# EasyEDA Pro project ProDoc_v03_CLOCK_4Plane_2025-01-28.epro

# Schematic v03_CLOCK_4Plane

## Sheets
1 v03_CLOCK_4Plane_Page1: Board Name: v03_CLOCK_4Plane; Create Date: 2024-08-20; Page Name: v03_CLOCK_4Plane_Page1; Project Name: The20c_v03; Schematic Name: v03_CLOCK_4Plane; Update Date: 2024-12-30; Company: OsoLabs.tech; Drawn: OsoLabs.tech; Page Size: A4; Part Number: v03_CLOCK_4Plane; Reviewed: OsoLabs.tech; Version: V3.0
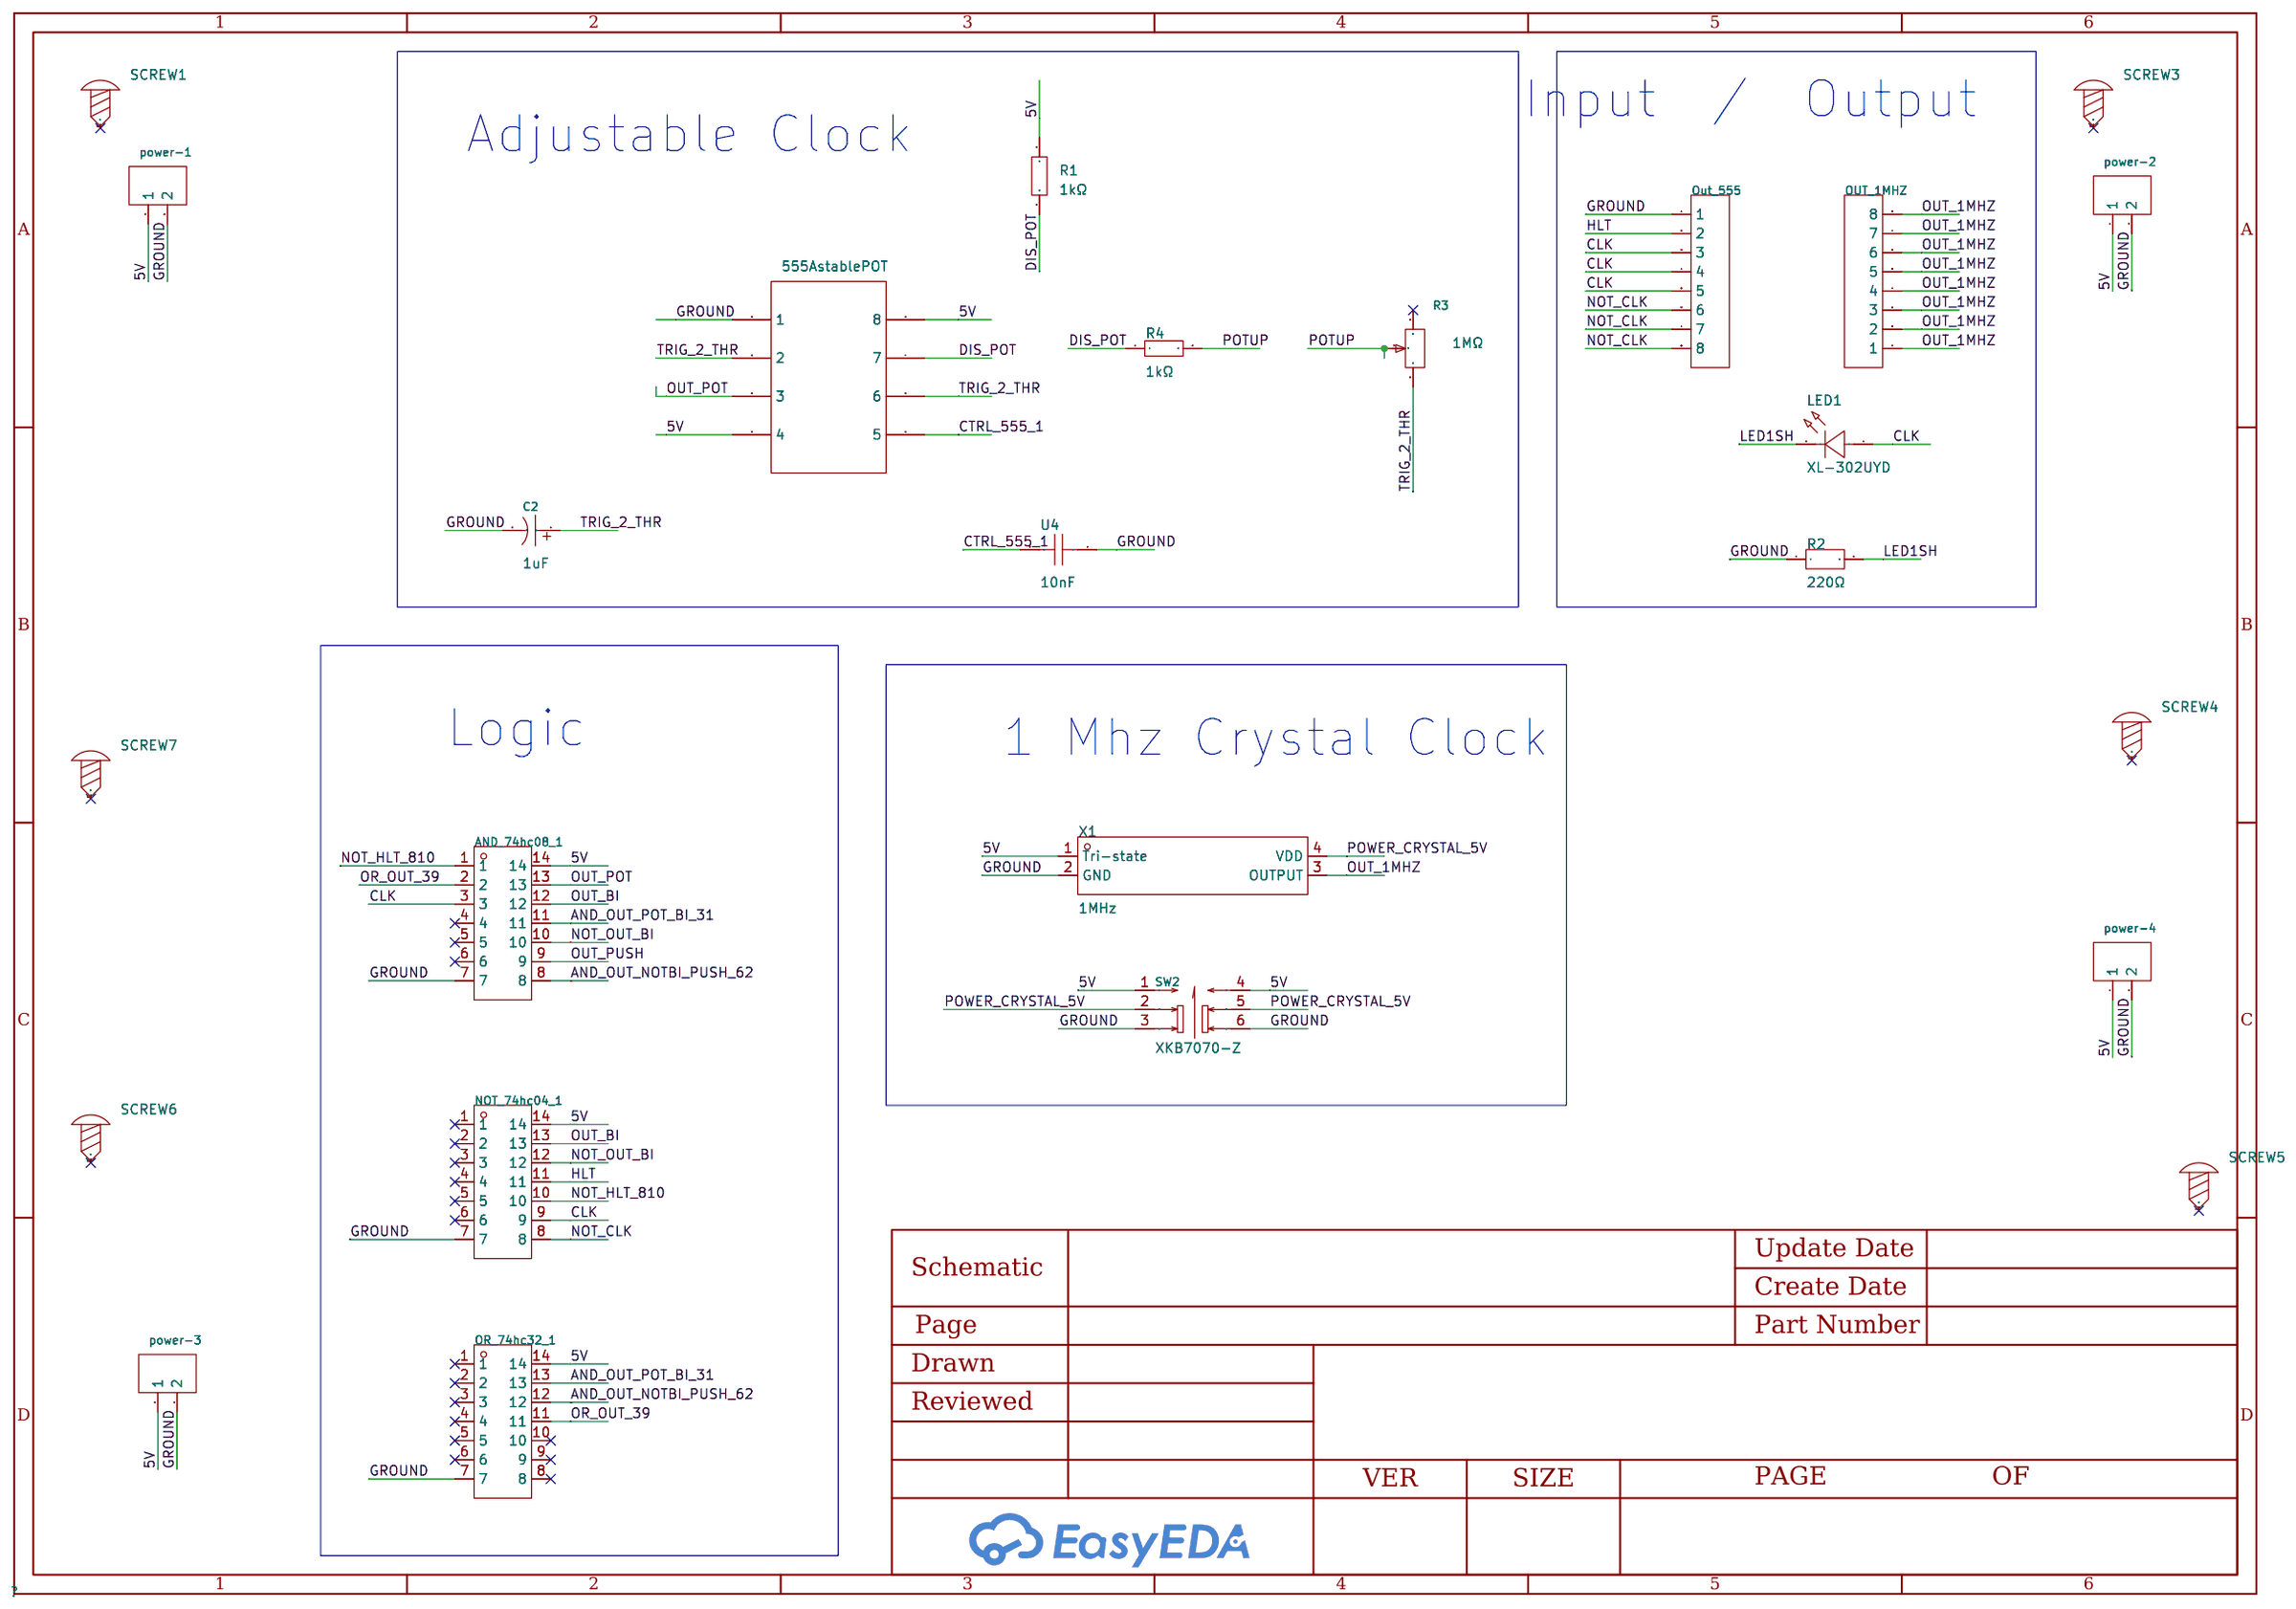
[diagram p0: v03_CLOCK_4Plane_Page1]
2 v03_CLOCK_4Plane_Page2: Create Date: 2024-12-30; Page Name: v03_CLOCK_4Plane_Page2
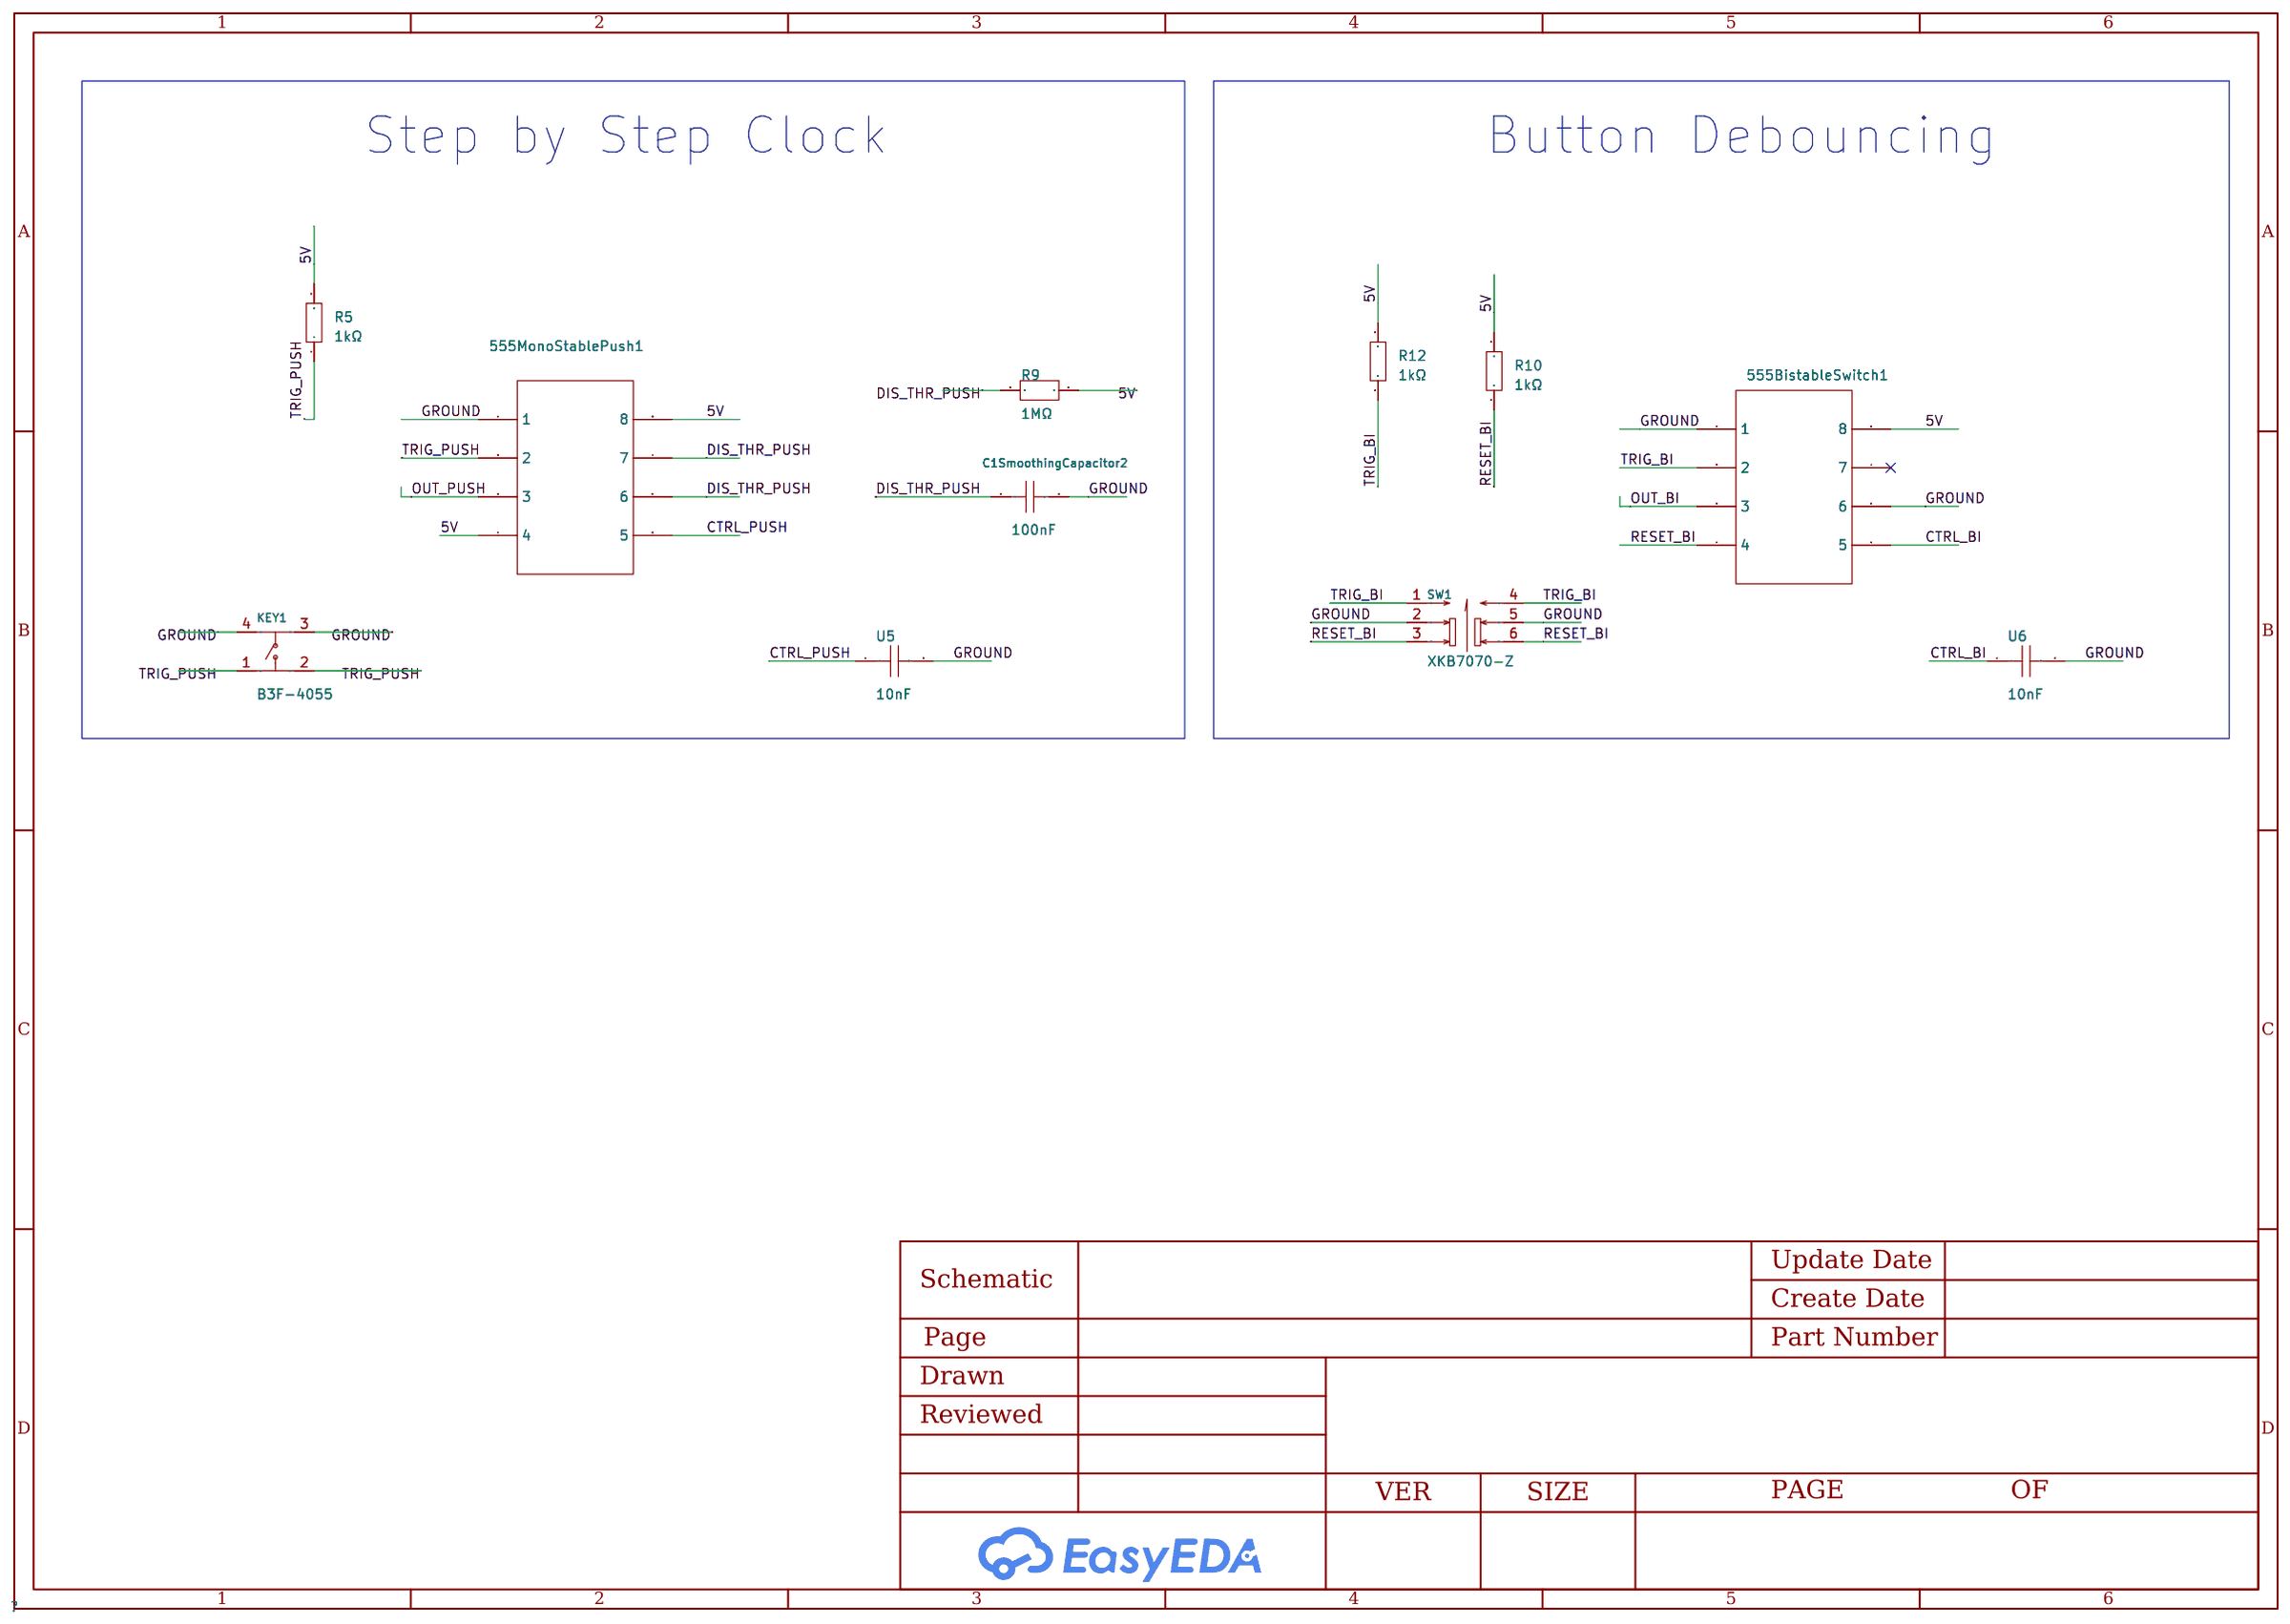
[diagram p1: v03_CLOCK_4Plane_Page2]

## Parts
sheet v03_CLOCK_4Plane_Page1
555AstablePOT  DS1009-08AT1NX-0A2  [DIP-8_L10.2-W10.2-P2.54-LS7.6-BL]
AND_74hc08_1  IC-14P窄  [DIP-14_L17.8-W10.2-P2.54-BL]
C2  1uF  [CAP-TH_BD5.0-P2.00-D0.8-FD]
LED1  XL-302UYD  [LED-TH_BD3.8-P2.54-FD_YELLOW]
NOT_74hc04_1  IC-14P窄  [DIP-14_L17.8-W10.2-P2.54-BL]
OR_74hc32_1  IC-14P窄  [DIP-14_L17.8-W10.2-P2.54-BL]
OUT_1MHZ  2.54-1*8P母环保  [HDR-TH_8P-P2.54-V-F-1]
Out_555  2.54-1*8P母环保  [HDR-TH_8P-P2.54-V-F-1]
power-1  2.54-1*2P母  [HDR-TH_2P-P2.54-V-F]
power-2  2.54-1*2P母  [HDR-TH_2P-P2.54-V-F]
power-3  2.54-1*2P母  [HDR-TH_2P-P2.54-V-F]
power-4  2.54-1*2P母  [HDR-TH_2P-P2.54-V-F]
R1  1kΩ  [RES-TH_BD2.7-L6.2-P10.20-D0.4]
R2  220Ω  [RES-TH_BD2.7-L6.2-P10.20-D0.4]
R3  1MΩ  [RES-ADJ-TH_3296W]
R4  1kΩ  [RES-TH_BD2.7-L6.2-P10.20-D0.4]
SCREW1  -  [Screw-Hole-M3]
SCREW3  -  [Screw-Hole-M3]
SCREW4  -  [Screw-Hole-M3]
SCREW5  -  [Screw-Hole-M3]
SCREW6  -  [Screw-Hole-M3]
SCREW7  -  [Screw-Hole-M3]
SW2  XKB7070-Z  [SW-TH_6P-L7.0-W7.0-P2.00]
U4  10nF  [CAP-TH_L4.8-W3.2-P5.08-D1.2]
X1  1MHz  [OSC-SMD_4P-L7.0-W5.0-BL_7W16070003]
sheet v03_CLOCK_4Plane_Page2
555BistableSwitch1  DS1009-08AT1NX-0A2  [DIP-8_L10.2-W10.2-P2.54-LS7.6-BL]
555MonoStablePush1  DS1009-08AT1NX-0A2  [DIP-8_L10.2-W10.2-P2.54-LS7.6-BL]
C1SmoothingCapacitor2  100nF  [CAP-TH_L5.8-W2.4-P2.54-D0.6]
KEY1  B3F-4055  [KEY-TH_4P-L12.0-W12.0-P5.00-LS13.4-EH]
R5  1kΩ  [RES-TH_BD2.7-L6.2-P10.20-D0.4]
R9  1MΩ  [RES-TH_BD2.7-L6.2-P10.20-D0.4]
R10  1kΩ  [RES-TH_BD2.7-L6.2-P10.20-D0.4]
R12  1kΩ  [RES-TH_BD2.7-L6.2-P10.20-D0.4]
SW1  XKB7070-Z  [SW-TH_6P-L7.0-W7.0-P2.00]
U5  10nF  [CAP-TH_L4.8-W3.2-P5.08-D1.2]
U6  10nF  [CAP-TH_L4.8-W3.2-P5.08-D1.2]

## Library data of the parts
555AstablePOT 555BistableSwitch1 555MonoStablePush1 = DS1009-08AT1NX-0A2: IC Type:DIP Pitch:2.54mm Row Spacing:7.62mm Number of Positions:8P Contact Plating:Tin; LCSC Part Name: 间距2.54mm P数:8P; Supplier Part: C72124; Manufacturer: CONNFLY; Supplier Footprint: DIP-8; JLCPCB Part Class: Extended Part; Datasheet: https://atta.szlcsc.com/upload/public/pdf/source/20160429/1461922462758.pdf; Supplier: LCSC; IC Type: DIP; Pitch: 2.54mm; Row Spacing: 7.62mm; Number of Positions: 8P; Contact Plating: Tin
AND_74hc08_1 NOT_74hc04_1 OR_74hc32_1 = IC-14P窄: IC Type:DIP Pitch:2.54mm Row Spacing:7.62mm Number of Positions:14P Contact Plating:-; LCSC Part Name: 间距2.54mm P数:14P; Supplier Part: C2325; Manufacturer: BOOMELE(博穆精密); Supplier Footprint: DIP-14; JLCPCB Part Class: Extended Part; Datasheet: https://atta.szlcsc.com/upload/public/pdf/source/20151118/1457707579760.pdf; Supplier: LCSC; IC Type: DIP; Pitch: 2.54mm; Row Spacing: 7.62mm; Number of Positions: 14P
C2 = KF010M050C110A: Capacitance: Tolerance:±20% Tolerance:±20% Rated Voltage: Lead Spacing: φD: L: Lifetime @ Temp:2000hrs@105℃; LCSC Part Name: 1uF ±20% 50V; Supplier Part: C62934; Manufacturer: CapXon(丰宾); Supplier Footprint: 插件,D5xL11mm; JLCPCB Part Class: Extended Part; Datasheet: https://atta.szlcsc.com/upload/public/pdf/source/20160702/1467448308274.pdf; Supplier: LCSC; Tolerance: ±20%; Lifetime @ Temp: 2000hrs@105℃
LED1 = XL-302UYD: Lamp Holder Type:3mm圆形灯头 Emitted Color:Yellow Power Dissipation:80mW Forward Current:30mA Dominant Wavelength:585nm~590nm Dominant Wavelength:585nm~590nm Peak Wavelength:595nm Lens Color:黄色透镜 Color Temperature:- Color Temperature:- Viewing Angle:50° Mount; Supplier Part: C2895472; Manufacturer: XINGLIGHT(成兴光); Supplier Footprint: 插件,D=3mm; JLCPCB Part Class: Extended Part; Datasheet: https://atta.szlcsc.com/upload/public/pdf/source/20240112/80AE8C6861133F27C2471F21BB0705B6.pdf; Supplier: LCSC; Lamp Holder Type: 3mm圆形灯头; Emitted Color: Yellow; Power Dissipation: 80mW; Forward Current: 30mA; Dominant Wavelength: 585nm~590nm; Peak Wavelength: 595nm; Lens Color: 黄色透镜; Viewing Angle: 50°; Operating Temperature: -25℃~+85℃
OUT_1MHZ Out_555 = 2.54-1*8P母环保: Holes Structure:1x8P Pitch:2.54mm Row Spacing:- Mounting Type:Straight Number of Rows:Plugin Number of Holes:8P Insulation Height:- Contact Material:- Contact Plating:-; LCSC Part Name: 间距:2.54mm 1x8P 直插; Supplier Part: C27438; Manufacturer: BOOMELE(博穆精密); Supplier Footprint: 插件,P=2.54mm; JLCPCB Part Class: Extended Part; Datasheet: https://atta.szlcsc.com/upload/public/pdf/source/20231221/1CA800C6799ED97958773716FAA1BFFE.pdf; Supplier: LCSC; Holes Structure: 1x8P; Pitch: 2.54mm; Mounting Type: Straight; Number of Rows: Plugin; Number of Holes: 8P
power-1-power-4 = 2.54-1*2P母: Holes Structure:1x2P Pitch:2.54mm Row Spacing:- Mounting Type:Straight Number of Rows:Plugin Number of Holes:2P Insulation Height:- Contact Material:- Contact Plating:-; LCSC Part Name: 间距:2.54mm 1x2P 直插; Supplier Part: C49661; Manufacturer: BOOMELE(博穆精密); Supplier Footprint: 插件,P=2.54mm; JLCPCB Part Class: Extended Part; Datasheet: https://atta.szlcsc.com/upload/public/pdf/source/20210301/C2718488_F4427B881E42CAA8DDB0B1C12B3A522C.pdf; Supplier: LCSC; Holes Structure: 1x2P; Pitch: 2.54mm; Mounting Type: Straight; Number of Rows: Plugin; Number of Holes: 2P
R1 R4 R5 R10 R12 = CR1/4W-1K±5%-ST26: Type:Carbon Resister Resistance: Tolerance:±5% Tolerance:±5% Overload Voltage (Max):250V Power(Watts):250mW Temperature Coefficient:±350ppm/℃ Temperature Coefficient:±350ppm/℃ Operating Temperature Range:-55℃~+155℃ Operating Temperature Range:-55℃~+155℃; LCSC Part Name: 碳膜电阻 1kΩ ±5% 250mW; Supplier Part: C2894606; Manufacturer: VO(翔胜); Supplier Footprint: 插件,2.7x6.2mm; JLCPCB Part Class: Extended Part; Datasheet: https://atta.szlcsc.com/upload/public/pdf/source/20210803/C2857407_45FF53FE186CAB545115AD37303966CD.pdf; Supplier: LCSC; Type: Carbon Resister; Tolerance: ±5%; Overload Voltage (Max): 250V; Power(Watts): 250mW; Temperature Coefficient: ±350ppm/℃; Operating Temperature Range: -55℃~+155℃
R2 = CR1/4W-220Ω±5%-ST26: Type:Carbon Resister Resistance: Tolerance:±5% Tolerance:±5% Overload Voltage (Max):250V Power(Watts):250mW Temperature Coefficient:±350ppm/℃ Temperature Coefficient:±350ppm/℃ Operating Temperature Range:-55℃~+155℃ Operating Temperature Range:-55℃~+155℃; LCSC Part Name: 碳膜电阻 220Ω ±5% 250mW; Supplier Part: C2894616; Manufacturer: VO(翔胜); Supplier Footprint: 插件,D2.7xL6.2mm; JLCPCB Part Class: Extended Part; Datasheet: https://atta.szlcsc.com/upload/public/pdf/source/20210803/C2857407_45FF53FE186CAB545115AD37303966CD.pdf; Supplier: LCSC; Type: Carbon Resister; Tolerance: ±5%; Overload Voltage (Max): 250V; Power(Watts): 250mW; Temperature Coefficient: ±350ppm/℃; Operating Temperature Range: -55℃~+155℃
R3 = 3296W-1-105-8mm: Resistance: Tolerance:±10% Tolerance:±10%; LCSC Part Name: 1MΩ ±10%; Supplier Part: C330438; Manufacturer: BOCHEN(博晨); Supplier Footprint: 插件; JLCPCB Part Class: Extended Part; Datasheet: https://atta.szlcsc.com/upload/public/pdf/source/20181127/C330438_D4133D377B8EE5AAFCEADB9B9868ED36.pdf; Supplier: LCSC; Tolerance: ±10%
SCREW1 SCREW3-SCREW7 = Screw-Hole-M3: Supplier Footprint: 插件
SW1 SW2 = XKB7070-Z: Self Lock / No Lock:LATCHING Actuator Style:Rectangle button IP Rating:- Mounting Style:Straight Contact Current:100mA Voltage Rating (AC):250V Voltage Rating (DC):30V Insulation Resistance:100MΩ Actuator/Cap Color:Blue With Lamp:不带 Pin Style:PCPin Operat; LCSC Part Name: 按键开关   7*7插件自锁 蓝白黑; Supplier Part: C318863; Manufacturer: XKB Connectivity(中国星坤); Supplier Footprint: 插件; JLCPCB Part Class: Extended Part; Datasheet: https://atta.szlcsc.com/upload/public/pdf/source/20211015/75A682A27A424BDE8D93C2CFA14C38FE.pdf; Supplier: LCSC; Self Lock / No Lock: LATCHING; Actuator Style: Rectangle button; Mounting Style: Straight; Contact Current: 100mA; Voltage Rating (AC): 250V; Voltage Rating (DC): 30V; Insulation Resistance: 100MΩ; Actuator/Cap Color: Blue; With Lamp: 不带; Pin Style: PCPin; Operating Force: 160gf; Operating Temperature: -15℃~+55℃; Mechanical Life: 10万次
U4-U6 = CC1H103ZC1ED3F4D1100: Capacitance:10nF Tolerance:-20%~+80% Tolerance:-20%~+80% Voltage Rated: Lead Spacing: Temperature Coefficient: φD: Body Thickness:2.6mm; LCSC Part Name: 10nF -20%~+80% 50V; Supplier Part: C2761727; Manufacturer: Dersonic(德尔创); Supplier Footprint: 插件,P=5.08mm; JLCPCB Part Class: Extended Part; Datasheet: https://atta.szlcsc.com/upload/public/pdf/source/20211026/557BD244E4A8D86E9C6A3DB53C19BB73.pdf; Supplier: LCSC; Tolerance: -20%~+80%; Body Thickness: 2.6mm
X1 = S7D1.000000A20F30T: Frequency:1MHz Normal temperature Frequency Tolerance:±20ppm Normal temperature Frequency Tolerance:±20ppm Output Type:CMOS Supply Voltage:5V Supply Voltage:5V Supply Current (Max):10mA Frequency Stability(Full temperature range):±30ppm Frequency Stabilit; LCSC Part Name: 1MHz ±20ppm 5V CMOS; Supplier Part: C386887; Manufacturer: SCTF(星通时频); Supplier Footprint: SMD7050-4P; JLCPCB Part Class: Extended Part; Datasheet: https://atta.szlcsc.com/upload/public/pdf/source/20220428/A9C559F2882A09E13E49EAE9C5A8F46A.pdf; Supplier: LCSC; Normal temperature Frequency Tolerance: ±20ppm; Output Type: CMOS; Supply Voltage: 5V; Supply Current (Max): 10mA; Frequency Stability(Full temperature range): ±30ppm; Operating Temperature: -40℃~+85℃
C1SmoothingCapacitor2 = CC1H104ZA1ED3F5P1100: Capacitance:100nF Tolerance:-20%~+80% Tolerance:-20%~+80% Voltage Rated: Lead Spacing: Temperature Coefficient: φD: Body Thickness:2.4mm; LCSC Part Name: 100nF -20%~+80% 50V; Supplier Part: C2832506; Manufacturer: Dersonic(德尔创); Supplier Footprint: 插件,P=2.54mm; JLCPCB Part Class: Extended Part; Datasheet: https://atta.szlcsc.com/upload/public/pdf/source/20211027/619020FDD8EBC9BBFCA73A5584FA164D.pdf; Supplier: LCSC; Tolerance: -20%~+80%; Body Thickness: 2.4mm
KEY1 = B3F-4055_C84931: Circuit:SPST Actuator Style:Rectangle button Mounting Style:Straight Switch Length:12mm Switch Width:12mm Switch Height:7.3mm Contact Current:50mA Voltage Rating (DC):24V With Lamp:- Mechanical Life:-; LCSC Part Name: 12*12*7.3mm 直插 轻触开关; Supplier Part: C84931; Manufacturer: OMRON(欧姆龙); Supplier Footprint: 插件; JLCPCB Part Class: Extended Part; Datasheet: https://atta.szlcsc.com/upload/public/pdf/source/20170810/C93157_1502335414592880008.pdf; Supplier: LCSC; Circuit: SPST; Actuator Style: Rectangle button; Mounting Style: Straight; Switch Length: 12mm; Switch Width: 12mm; Switch Height: 7.3mm; Contact Current: 50mA; Voltage Rating (DC): 24V
R9 = CR1/4W-1M±5%-ST52: Type:Carbon Resister Resistance: Tolerance:±5% Tolerance:±5% Overload Voltage (Max):250V Power(Watts):250mW Temperature Coefficient:±1000ppm/℃ Temperature Coefficient:±1000ppm/℃ Operating Temperature Range:-55℃~+155℃ Operating Temperature Range:-55℃~+155℃; LCSC Part Name: 碳膜电阻 1MΩ ±5% 250mW; Supplier Part: C2894664; Manufacturer: VO(翔胜); Supplier Footprint: 插件,D2.7xL6.2mm; JLCPCB Part Class: Extended Part; Datasheet: https://atta.szlcsc.com/upload/public/pdf/source/20210803/C2857407_45FF53FE186CAB545115AD37303966CD.pdf; Supplier: LCSC; Type: Carbon Resister; Tolerance: ±5%; Overload Voltage (Max): 250V; Power(Watts): 250mW; Temperature Coefficient: ±1000ppm/℃; Operating Temperature Range: -55℃~+155℃

## Nets
5V: 555AstablePOT.4 555AstablePOT.8 555BistableSwitch1.8 555MonoStablePush1.4 555MonoStablePush1.8 AND_74hc08_1.14 NOT_74hc04_1.14 OR_74hc32_1.14 power-1.1 power-2.1 power-3.1 power-4.1 R1.2 R5.2 R9.1 R10.2 R12.2 SW2.1 SW2.4 X1.1(Tri-state)
AND_OUT_NOTBI_PUSH_62: AND_74hc08_1.8 OR_74hc32_1.12
AND_OUT_POT_BI_31: AND_74hc08_1.11 OR_74hc32_1.13
CLK: AND_74hc08_1.3 LED1.1(A) NOT_74hc04_1.9 Out_555.3 Out_555.4 Out_555.5
CTRL_555_1: 555AstablePOT.5 U4.1
CTRL_BI: 555BistableSwitch1.5 U6.1
CTRL_PUSH: 555MonoStablePush1.5 U5.1
DIS_POT: 555AstablePOT.7 R1.1 R4.1
DIS_THR_PUSH: 555MonoStablePush1.6 555MonoStablePush1.7 C1SmoothingCapacitor2.1 R9.2
GROUND: 555AstablePOT.1 555BistableSwitch1.1 555BistableSwitch1.6 555MonoStablePush1.1 AND_74hc08_1.7 C1SmoothingCapacitor2.2 C2.2 KEY1.3 KEY1.4 NOT_74hc04_1.7 OR_74hc32_1.7 Out_555.1 power-1.2 power-2.2 power-3.2 power-4.2 R2.1 SW1.2 SW1.5 SW2.3 SW2.6 U4.2 U5.2 U6.2 X1.2(GND)
HLT: NOT_74hc04_1.11 Out_555.2
LED1SH: LED1.2(K) R2.2
NOT_CLK: NOT_74hc04_1.8 Out_555.6 Out_555.7 Out_555.8
NOT_HLT_810: AND_74hc08_1.1 NOT_74hc04_1.10
NOT_OUT_BI: AND_74hc08_1.10 NOT_74hc04_1.12
OR_OUT_39: AND_74hc08_1.2 OR_74hc32_1.11
OUT_1MHZ: OUT_1MHZ.1 OUT_1MHZ.2 OUT_1MHZ.3 OUT_1MHZ.4 OUT_1MHZ.5 OUT_1MHZ.6 OUT_1MHZ.7 OUT_1MHZ.8 X1.3(OUTPUT)
OUT_BI: 555BistableSwitch1.3 AND_74hc08_1.12 NOT_74hc04_1.13
OUT_POT: 555AstablePOT.3 AND_74hc08_1.13
OUT_PUSH: 555MonoStablePush1.3 AND_74hc08_1.9
POTUP: R3.2 R4.2
POWER_CRYSTAL_5V: SW2.2 SW2.5 X1.4(VDD)
RESET_BI: 555BistableSwitch1.4 R10.1 SW1.3 SW1.6
TRIG_2_THR: 555AstablePOT.2 555AstablePOT.6 C2.1 R3.3
TRIG_BI: 555BistableSwitch1.2 R12.1 SW1.1 SW1.4
TRIG_PUSH: 555MonoStablePush1.2 KEY1.1 KEY1.2 R5.1

Not connected (* = marked no-connect by the designer): 555BistableSwitch1 7*; AND_74hc08_1 4* 5* 6*; NOT_74hc04_1 1* 2* 3* 4* 5* 6*; OR_74hc32_1 1* 2* 3* 4* 5* 6* 8* 9* 10*; R3 1*; SCREW1 1*; SCREW3 1*; SCREW4 1*; SCREW5 1*; SCREW6 1*; SCREW7 1*

## Notes on the sheets
sheet 1
- Input  /  Output
- Adjustable Clock
- Logic
- 1 Mhz Crystal Clock
sheet 2
- Step by Step Clock
- Button Debouncing

# Board v03_CLOCK_4Plane
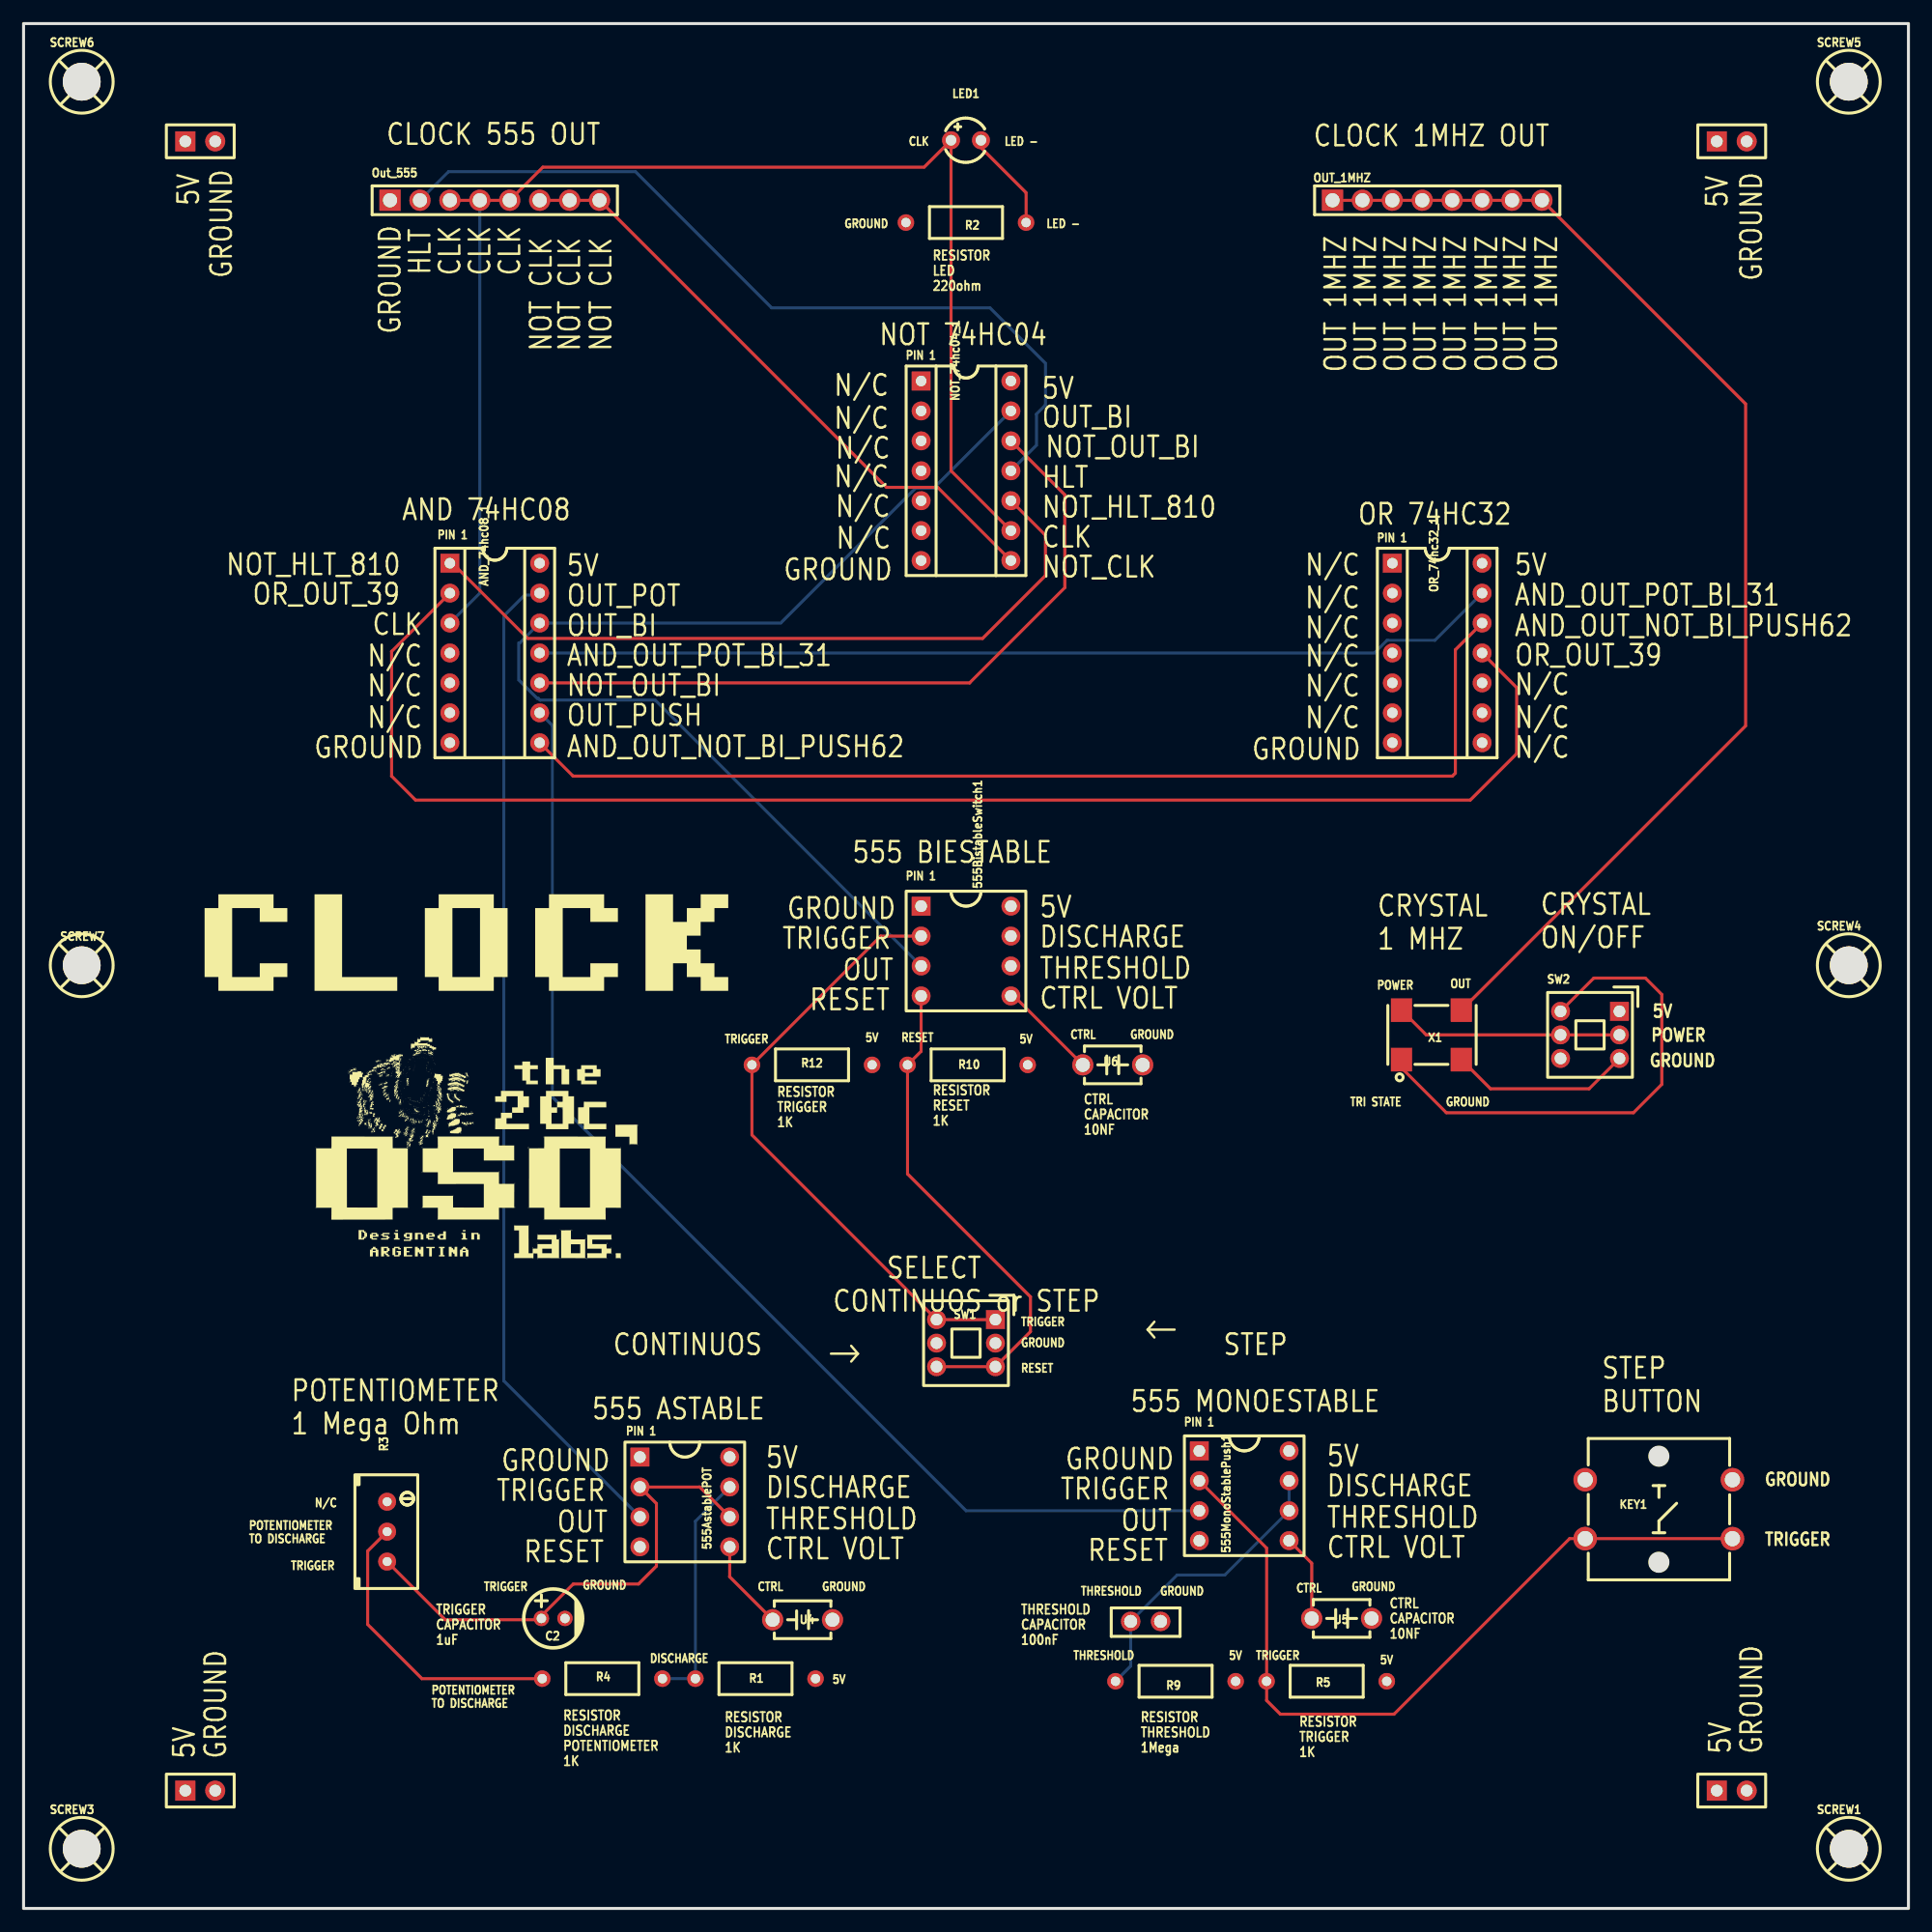
[diagram p2: board, top side]
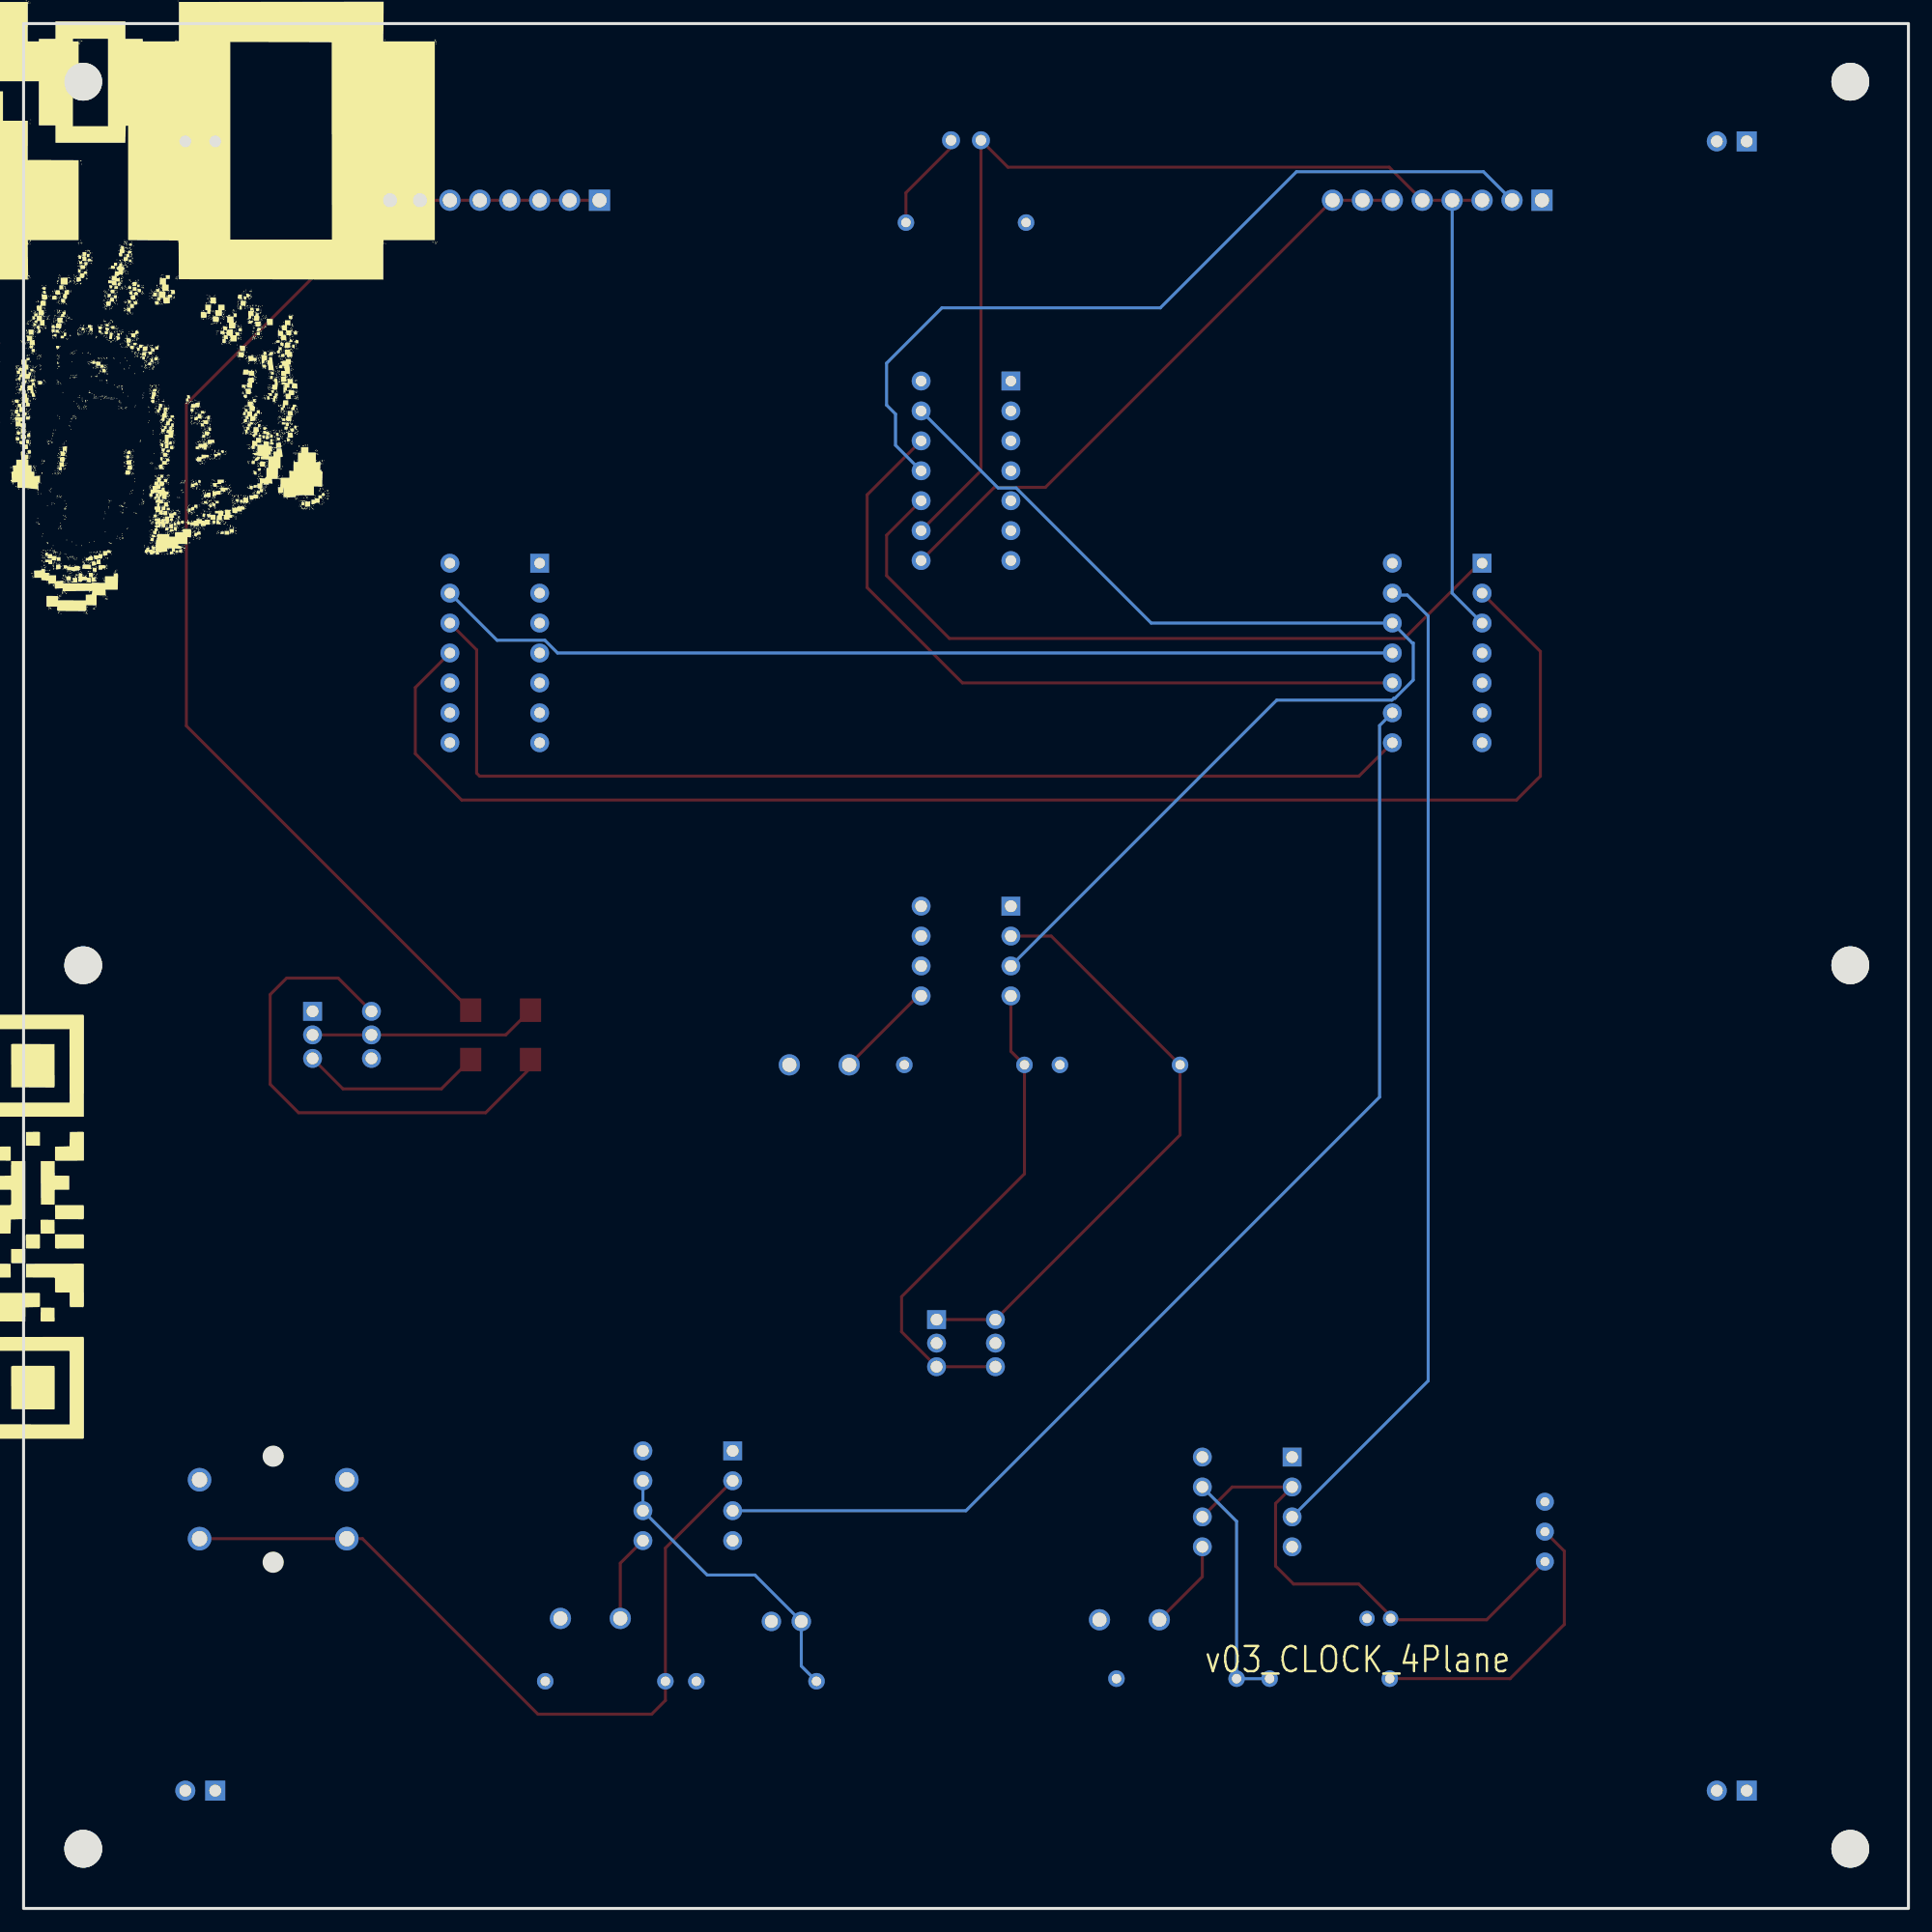
[diagram p3: board, bottom side, seen from below]

Outline 160 x 160 mm; copper layers: Top Layer, GROUND, 5V, Bottom Layer. Coordinates in mm from the lower left corner of the outline.
Outline path: rectangle 0,160 160,0
Stack: Top Layer 0.035mm 外层铜厚1oz / Dielectric1 0.2104mm 7628 RC49% 8.6mil / GROUND 0.0152mm 内层铜厚 / Dielectric2 1.065mm 1.1mm H/HOZ 含铜 / 5V 0.0152mm 内层铜厚 / Dielectric3 0.2104mm 7628 RC49% 8.6mil / Bottom Layer 0.035mm 外层铜厚1oz

## Design rules (mm)
template: Custom Config
spacing copperThickness1oz (default): track to track 0.102, other pairs 0.152 to 0.3
spacing copperThickness2oz: track to track 0.203, other pairs 0.152 to 0.3
track width copperThickness1oz (default): min 0.127, default 0.254, max 2.54
track width copperThickness2oz: min 0.203, default 0.254, max 2.54
differential pair differentialPair (default): width min 0.127, default 0.254, max 2.54; gap min 0.152, default 0.152
via viaSize (default): diameter min 0.5, default 0.61, max 10; hole min 0.3, default 0.305, max 6.299
net 5V uses 5VPlane

## Placement (name value [footprint] x y rotation side)
555AstablePOT  DS1009-08AT1NX-0A2  [DIP-8_L10.2-W10.2-P2.54-LS7.6-BL]  56.13 34.51 270 top
555BistableSwitch1  DS1009-08AT1NX-0A2  [DIP-8_L10.2-W10.2-P2.54-LS7.6-BL]  80 81.27 270 top
555MonoStablePush1  DS1009-08AT1NX-0A2  [DIP-8_L10.2-W10.2-P2.54-LS7.6-BL]  103.62 35.03 270 top
AND_74hc08_1  IC-14P窄  [DIP-14_L17.8-W10.2-P2.54-BL]  40 106.57 270 top
C1SmoothingCapacitor2  100nF  [CAP-TH_L5.8-W2.4-P2.54-D0.6]  95.25 24.36 0 top
C2  1uF  [CAP-TH_BD5.0-P2.00-D0.8-FD]  44.96 24.62 0 top
KEY1  B3F-4055  [KEY-TH_4P-L12.0-W12.0-P5.00-LS13.4-EH]  138.81 33.89 0 top
LED1  XL-302UYD  [LED-TH_BD3.8-P2.54-FD_YELLOW]  80 150.09 0 top
NOT_74hc04_1  IC-14P窄  [DIP-14_L17.8-W10.2-P2.54-BL]  80 122.04 270 top
OR_74hc32_1  IC-14P窄  [DIP-14_L17.8-W10.2-P2.54-BL]  120 106.57 270 top
OUT_1MHZ  2.54-1*8P母环保  [HDR-TH_8P-P2.54-V-F-1]  120 145 0 top
Out_555  2.54-1*8P母环保  [HDR-TH_8P-P2.54-V-F-1]  40 145 0 top
power-1  2.54-1*2P母  [HDR-TH_2P-P2.54-V-F]  15 150 0 top
power-2  2.54-1*2P母  [HDR-TH_2P-P2.54-V-F]  145 150 0 top
power-3  2.54-1*2P母  [HDR-TH_2P-P2.54-V-F]  15 10 0 top
power-4  2.54-1*2P母  [HDR-TH_2P-P2.54-V-F]  145 10 0 top
R1  1kΩ  [RES-TH_BD2.7-L6.2-P10.20-D0.4]  62.13 19.51 0 top
R2  220Ω  [RES-TH_BD2.7-L6.2-P10.20-D0.4]  80 143.11 0 top
R3  1MΩ  [RES-ADJ-TH_3296W]  30.86 31.98 0 top
R4  1kΩ  [RES-TH_BD2.7-L6.2-P10.20-D0.4]  49.13 19.51 180 top
R5  1kΩ  [RES-TH_BD2.7-L6.2-P10.20-D0.4]  110.62 19.28 0 top
R9  1MΩ  [RES-TH_BD2.7-L6.2-P10.20-D0.4]  97.79 19.28 180 top
R10  1kΩ  [RES-TH_BD2.7-L6.2-P10.20-D0.4]  80.14 71.61 0 top
R12  1kΩ  [RES-TH_BD2.7-L6.2-P10.20-D0.4]  66.93 71.61 0 top
SCREW1  -  [Screw-Hole-M3]  155 5 0 top
SCREW3  -  [Screw-Hole-M3]  5 5 0 top
SCREW4  -  [Screw-Hole-M3]  155 80 0 top
SCREW5  -  [Screw-Hole-M3]  155 155 0 top
SCREW6  -  [Screw-Hole-M3]  5 155 0 top
SCREW7  -  [Screw-Hole-M3]  5 80 0 top
SW1  XKB7070-Z  [SW-TH_6P-L7.0-W7.0-P2.00]  80 47.99 0 top
SW2  XKB7070-Z  [SW-TH_6P-L7.0-W7.0-P2.00]  132.97 74.15 0 top
U4  10nF  [CAP-TH_L4.8-W3.2-P5.08-D1.2]  66.13 24.51 0 top
U5  10nF  [CAP-TH_L4.8-W3.2-P5.08-D1.2]  111.89 24.62 0 top
U6  10nF  [CAP-TH_L4.8-W3.2-P5.08-D1.2]  92.46 71.61 0 top
X1  1MHz  [OSC-SMD_4P-L7.0-W5.0-BL_7W16070003]  119.51 74.15 0 top

## Footprints (pads in the part's own frame, mm; a bottom-side part is the same pattern mirrored in y, then rotated)
CAP-TH_BD5.0-P2.00-D0.8-FD
  round 1.3 hole 0.8: 1(-1,0) 2(1,0)
CAP-TH_L4.8-W3.2-P5.08-D1.2
  round 1.8 hole 1.2: 1(-2.54,0) 2(2.54,0)
CAP-TH_L5.8-W2.4-P2.54-D0.6
  round 1.65 hole 1.1: 1(-1.27,0) 2(1.27,0)
DIP-8_L10.2-W10.2-P2.54-LS7.6-BL
  rect 1.6x1.6 hole 1: 1(-3.808,-3.81)
  round 1.6 hole 1: 2(-1.27,-3.81) 3(1.27,-3.81) 4(3.81,-3.81) 5(3.81,3.81) 6(1.27,3.81) 7(-1.27,3.81) 8(-3.81,3.81)
DIP-14_L17.8-W10.2-P2.54-BL
  rect 1.6x1.6 hole 0.9: 1(-7.62,-3.81)
  round 1.6 hole 0.9: 2(-5.08,-3.81) 3(-2.54,-3.81) 4(0,-3.81) 5(2.54,-3.81) 6(5.08,-3.81) 7(7.62,-3.81) 8(7.62,3.81) 9(5.08,3.81) 10(2.54,3.81) 11(0,3.81) 12(-2.54,3.81) 13(-5.08,3.81) 14(-7.62,3.81)
HDR-TH_2P-P2.54-V-F
  rect 1.7x1.7 hole 1: 1(-1.27,0)
  round 1.7 hole 1: 2(1.27,0)
HDR-TH_8P-P2.54-V-F-1
  rect 1.8x1.8 hole 1.2: 1(-8.89,0)
  round 1.8 hole 1.2: 2(-6.35,0) 3(-3.81,0) 4(-1.27,0) 5(1.27,0) 6(3.81,0) 7(6.35,0) 8(8.89,0)
KEY-TH_4P-L12.0-W12.0-P5.00-LS13.4-EH
  round 2 hole 1.3: 1(6.25,-2.5) 2(-6.25,-2.5) 3(6.25,2.5) 4(-6.25,2.5)
LED-TH_BD3.8-P2.54-FD_YELLOW
  round 1.524 hole 0.9: 1(-1.27,0) 2(1.27,0)
OSC-SMD_4P-L7.0-W5.0-BL_7W16070003
  rect 1.8x2 smd: 1(-2.54,-2.1) 2(2.54,-2.1) 3(2.54,2.1) 4(-2.54,2.1)
RES-ADJ-TH_3296W
  round 1.524 hole 0.762: 1(0,2.54) 2(0,0) 3(0,-2.54)
RES-TH_BD2.7-L6.2-P10.20-D0.4
  round 1.4 hole 0.8: 1(-5.1,0) 2(5.1,0)
Screw-Hole-M3
  round 3.2 hole 3.2: 1(-0.064,0.064)
SW-TH_6P-L7.0-W7.0-P2.00
  rect 1.6x1.6 hole 1: 1(2.499,2)
  round 1.6 hole 1: 2(2.5,0) 3(2.5,-2) 4(-2.5,2) 5(-2.5,0) 6(-2.5,-2)

## Nets
As in the schematic.

Pads without a net: 555BistableSwitch1 7; AND_74hc08_1 4 5 6; NOT_74hc04_1 1 2 3 4 5 6; OR_74hc32_1 1 2 3 4 5 6 8 9 10; R3 1; SCREW1 1; SCREW3 1; SCREW4 1; SCREW5 1; SCREW6 1; SCREW7 1

## Routing (per net, layer and track width the routed paths; a pad name or vN(x,y) marks a point on that pad's centre or on a via; arc(x,y) is an arc through that point)
5V: length 43.3
  Top Layer w0.254: 116.97,72.05 116.97,71.35 120.78,67.54 136.65,67.54 139.06,69.96 139.06,77.58 137.67,78.97 133.29,78.97 SW2.4
AND_OUT_NOTBI_PUSH_62: length 92.7
  Top Layer w0.254: AND_74hc08_1.8 46.64,96.12 121.28,96.12 121.54,96.37 121.54,106.84 OR_74hc32_1.12
AND_OUT_POT_BI_31: length 82.1
  Bottom Layer w0.254: OR_74hc32_1.13 119.81,107.65 115.74,107.65 114.66,106.57 AND_74hc08_1.11
CLK: length 116.8
  Top Layer w0.254: Out_555.3 Out_555.4 Out_555.5 44.08,147.81 76.44,147.81 LED1.1 78.73,122.04 83.81,116.96
  Bottom Layer w0.254: Out_555.4 38.73,111.65 AND_74hc08_1.3
CTRL_555_1: length 7.7
  Top Layer w0.254: 555AstablePOT.5 59.94,28.16 U4.1
CTRL_BI: length 8.5
  Top Layer w0.254: 555BistableSwitch1.5 84.06,77.46 U6.1
CTRL_PUSH: length 7.4
  Top Layer w0.254: U5.1 109.35,29.3 555MonoStablePush1.5
DIS_POT: length 20.3
  Bottom Layer w0.254: R4.1 R1.1 57.03,32.87 555AstablePOT.7
DIS_THR_PUSH: length 25.5
  Bottom Layer w0.254: R9.2 93.98,20.57 C1SmoothingCapacitor2.1 97.92,28.3 101.97,28.3 555MonoStablePush1.6 555MonoStablePush1.7
GROUND: length 15.5
  Top Layer w0.254: SW2.3 132.89,69.58 124.52,69.58 122.05,72.05
HLT: length 71.2
  Bottom Layer w0.254: Out_555.2 36.08,147.43 51.94,147.43 63.5,135.87 82.04,135.87 86.74,131.17 86.74,127.62 85.98,126.85 85.98,124.21 NOT_74hc04_1.11
LED1SH: length 8.6
  Top Layer w0.254: LED1.2 81.27,149.47 85.1,145.64 R2.2
NOT_CLK: length 52.7
  Top Layer w0.254: NOT_74hc04_1.8 77.6,120.63 73.26,120.63 Out_555.8 Out_555.7 Out_555.6
NOT_HLT_810: length 63
  Top Layer w0.254: NOT_74hc04_1.10 86.74,116.57 86.74,113.14 81.41,107.8 42.8,107.8 36.41,114.19 AND_74hc08_1.1
NOT_OUT_BI: length 62.3
  Top Layer w0.254: 43.81,104.03 80.3,104.03 88.39,112.12 88.39,120 83.81,124.58
OR_OUT_39: length 125.3
  Top Layer w0.254: AND_74hc08_1.2 31.24,106.7 31.24,96.12 33.27,94.09 122.81,94.09 126.75,98.02 126.75,103.64 OR_74hc32_1.11
OUT_1MHZ: length 103.7
  Top Layer w0.254: X1.3 146.18,100.38 146.18,127.71 OUT_1MHZ.8 OUT_1MHZ.7 OUT_1MHZ.6 OUT_1MHZ.5 OUT_1MHZ.4 OUT_1MHZ.3 OUT_1MHZ.2 OUT_1MHZ.1
OUT_BI: length 97.3
  Bottom Layer w0.254: 555BistableSwitch1.3 53.62,102.57 43.84,102.57 43.69,102.72 43.59,102.72 42.04,104.28 42.04,107.42 42.12,107.42 AND_74hc08_1.12 64.28,109.11 75.74,120.58 77.27,120.58 83.81,127.12
OUT_POT: length 85.1
  Bottom Layer w0.254: AND_74hc08_1.13 43.64,111.49 42.55,111.49 40.77,109.71 40.77,44.79 555AstablePOT.3
OUT_PUSH: length 102.5
  Bottom Layer w0.254: AND_74hc08_1.9 44.89,100.41 44.89,68.88 80.01,33.76 555MonoStablePush1.3
POTUP: length 25.3
  Top Layer w0.254: R3.2 29.21,30.33 29.21,24.11 33.81,19.51 44.03,19.51
POWER_CRYSTAL_5V: length 19.4
  Top Layer w0.254: X1.4 119.07,74.15 SW2.5 SW2.2
RESET_BI: length 42.5
  Top Layer w0.254: 555BistableSwitch1.4 76.19,72.76 R10.1 75.04,62.36 85.47,51.92 85.47,48.96 SW1.3 SW1.6
TRIG_2_THR: length 42.8
  Top Layer w0.254: 555AstablePOT.6 57.4,35.78 555AstablePOT.2 53.72,34.37 53.72,29.06 52.2,27.54 46.66,27.54 43.63,24.51 35.8,24.51 R3.3
TRIG_BI: length 52
  Top Layer w0.254: 555BistableSwitch1.2 72.76,82.54 R12.1 61.83,65.66 SW1.4 SW1.1
TRIG_PUSH: length 67.2
  Top Layer w0.254: KEY1.1 KEY1.2 131.23,31.39 116.33,16.49 106.68,16.49 105.52,17.65 R5.1 105.52,30.59 555MonoStablePush1.2

## Copper pours and planes (outline as drawn; the poured copper is in the pictures)
5V on 5V: 2,158 158,158 158,2 2,2
GROUND on GROUND: 0.26,159.74 159.74,159.74 159.74,0.26 0.26,0.26

Small or netless copper shapes (teardrops, artwork), in the pictures only: 90 on GROUND, 74 on 5V

## Text on the board
Bottom Silkscreen Layer: v03_CLOCK_4Plane
Top Silkscreen Layer: PIN 1 | GROUND | CTRL | CLK | LED - | OUT | POTENTIOMETER / TO DISCHARGE | DISCHARGE | TRIGGER | 5V | RESET | THRESHOLD | TRI STATE | POWER | N/C | TRIGGER / CAPACITOR / 1uF | RESISTOR / DISCHARGE / POTENTIOMETER / 1K | RESISTOR / DISCHARGE / 1K | RESISTOR / TRIGGER / 1K | RESISTOR / LED / 220ohm | RESISTOR / RESET / 1K | THRESHOLD / CAPACITOR / 100nF | CTRL / CAPACITOR / 10NF | RESISTOR / THRESHOLD / 1Mega | CLOCK 555 OUT | CLOCK 1MHZ OUT | POTENTIOMETER / 1 Mega Ohm | AND 74HC08 | 555 ASTABLE | CONTINUOS | 555 BIESTABLE | SELECT / CONTINUOS or STEP | NOT 74HC04 | 555 MONOESTABLE | STEP | OR 74HC32 | CRYSTAL / 1 MHZ | CRYSTAL / ON/OFF | STEP / BUTTON | OUT_BI | NOT_OUT_BI | AND_OUT_POT_BI_31 | AND_OUT_NOT_BI_PUSH62 | HLT | NOT CLK | OUT 1MHZ | CTRL VOLT | NOT_HLT_810 | NOT_CLK | OR_OUT_39 | OUT_POT | OUT_PUSH | →
